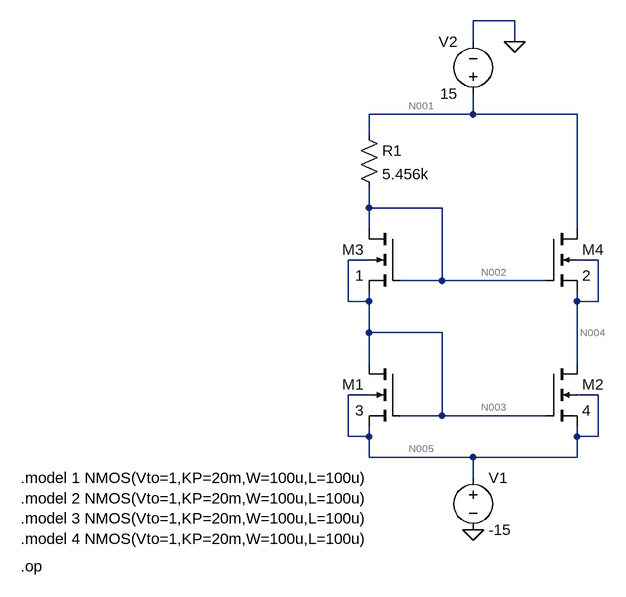
[diagram p0: schematic question_2.asc]
question_2.asc, the LTspice schematic file:
Version 4.1
SHEET 1 880 680
WIRE 144 -176 80 -176
WIRE 80 -144 80 -176
WIRE 144 -144 144 -176
WIRE 80 -32 80 -64
WIRE 80 -32 -80 -32
WIRE 240 -32 80 -32
WIRE -80 0 -80 -32
WIRE -80 112 -80 80
WIRE 32 112 -80 112
WIRE -80 144 -80 112
WIRE 240 144 240 -32
WIRE -80 192 -112 192
WIRE 272 192 240 192
WIRE 32 224 32 112
WIRE 32 224 -32 224
WIRE 192 224 32 224
WIRE -112 256 -112 192
WIRE -80 256 -80 240
WIRE -80 256 -112 256
WIRE 240 256 240 240
WIRE 272 256 272 192
WIRE 272 256 240 256
WIRE -80 304 -80 256
WIRE 32 304 -80 304
WIRE -80 352 -80 304
WIRE 240 352 240 256
WIRE -80 400 -112 400
WIRE 272 400 240 400
WIRE 32 432 32 304
WIRE 32 432 -32 432
WIRE 192 432 32 432
WIRE -112 464 -112 400
WIRE -80 464 -80 448
WIRE -80 464 -112 464
WIRE 240 464 240 448
WIRE 272 464 272 400
WIRE 272 464 240 464
WIRE -80 496 -80 464
WIRE 80 496 -80 496
WIRE 240 496 240 464
WIRE 240 496 80 496
WIRE 80 528 80 496
FLAG 80 608 0
FLAG 144 -144 0
SYMBOL nmos4 192 144 R0
SYMATTR InstName M4
SYMATTR Value 2
SYMBOL nmos4 -32 144 M0
SYMATTR InstName M3
SYMATTR Value 1
SYMBOL nmos4 -32 352 M0
SYMATTR InstName M1
SYMATTR Value 3
SYMBOL nmos4 192 352 R0
SYMATTR InstName M2
SYMATTR Value 4
SYMBOL voltage 80 512 R0
WINDOW 123 0 0 Left 0
WINDOW 39 0 0 Left 0
SYMATTR InstName V1
SYMATTR Value -15
SYMBOL res -96 -16 R0
SYMATTR InstName R1
SYMATTR Value 5.456k
SYMBOL voltage 80 -48 R180
WINDOW 0 24 96 Left 2
WINDOW 3 24 16 Left 2
WINDOW 123 0 0 Left 0
WINDOW 39 0 0 Left 0
SYMATTR InstName V2
SYMATTR Value 15
TEXT -616 528 Left 2 !.model 1 NMOS(Vto=1,KP=20m,W=100u,L=100u)\n.model 2 NMOS(Vto=1,KP=20m,W=100u,L=100u)\n.model 3 NMOS(Vto=1,KP=20m,W=100u,L=100u)\n.model 4 NMOS(Vto=1,KP=20m,W=100u,L=100u)
TEXT -616 664 Left 2 !.op

The netlist it stands for:
* question_2.asc
M4 N001 N002 N004 N004 2
M3 N002 N002 N003 N003 1
M1 N003 N003 N005 N005 3
M2 N004 N003 N005 N005 4
V1 N005 0 -15
R1 N001 N002 5.456k
V2 N001 0 15
.model NMOS NMOS
.model PMOS PMOS
.lib standard.mos
.model 1 NMOS(Vto=1,KP=20m,W=100u,L=100u)
.model 2 NMOS(Vto=1,KP=20m,W=100u,L=100u)
.model 3 NMOS(Vto=1,KP=20m,W=100u,L=100u)
.model 4 NMOS(Vto=1,KP=20m,W=100u,L=100u)
.op
.backanno
.end

* Results of the author's LTspice run, read from the files saved beside the schematic
* Operating Point:
*   V(n002) = -11.6 V
*   V(n003) = -13.3 V
*   V(n005) = -15 V
*   V(n001) = 15 V
*   V(n004) = -13.3 V
*   Id(M4) = 4.876 mA
*   Ig(M4) = 0 A
*   Is(M4) = -4.876 mA
*   Ib(M4) = -28.31 pA
*   Id(M1) = 4.876 mA
*   Ig(M1) = 0 A
*   Is(M1) = -4.876 mA
*   Ib(M1) = -1.708 pA
*   I(V1) = 9.752 mA
*   I(R1) = 4.876 mA
*   Id(M3) = 4.876 mA
*   Ig(M3) = 0 A
*   Is(M3) = -4.876 mA
*   Ib(M3) = -1.708 pA
*   Id(M2) = 4.876 mA
*   Ig(M2) = 0 A
*   Is(M2) = -4.876 mA
*   Ib(M2) = -1.708 pA
*   I(V2) = -9.752 mA
* From the log:
*   Semiconductor Device Operating Points:
*                           --- MOSFET Transistors ---
*   Name:           M3          M4          M1          M2
*   Model:          1           2           3           4
*   Id:          4.88e-03    4.88e-03    4.88e-03    4.88e-03
*   Vgs:         1.70e+00    1.70e+00    1.70e+00    1.70e+00
*   Vds:         1.70e+00    2.83e+01    1.70e+00    1.70e+00
*   Vbs:         0.00e+00    0.00e+00    0.00e+00    0.00e+00
*   Vth:         1.00e+00    1.00e+00    1.00e+00    1.00e+00
*   Vdsat:       6.98e-01    6.98e-01    6.98e-01    6.98e-01
*   Gm:          1.40e-02    1.40e-02    1.40e-02    1.40e-02
*   Gds:         0.00e+00    0.00e+00    0.00e+00    0.00e+00
*   Gmb:         0.00e+00    0.00e+00    0.00e+00    0.00e+00
*   Cbd:         0.00e+00    0.00e+00    0.00e+00    0.00e+00
*   Cbs:         0.00e+00    0.00e+00    0.00e+00    0.00e+00
*   Cgsov:       0.00e+00    0.00e+00    0.00e+00    0.00e+00
*   Cgdov:       0.00e+00    0.00e+00    0.00e+00    0.00e+00
*   Cgbov:       0.00e+00    0.00e+00    0.00e+00    0.00e+00
*   Cgs:         0.00e+00    0.00e+00    0.00e+00    0.00e+00
*   Cgd:         0.00e+00    0.00e+00    0.00e+00    0.00e+00
*   Cgb:         0.00e+00    0.00e+00    0.00e+00    0.00e+00